# Altium schematic sheet construccionTransformador.SchDoc
size 145 x 103 mm
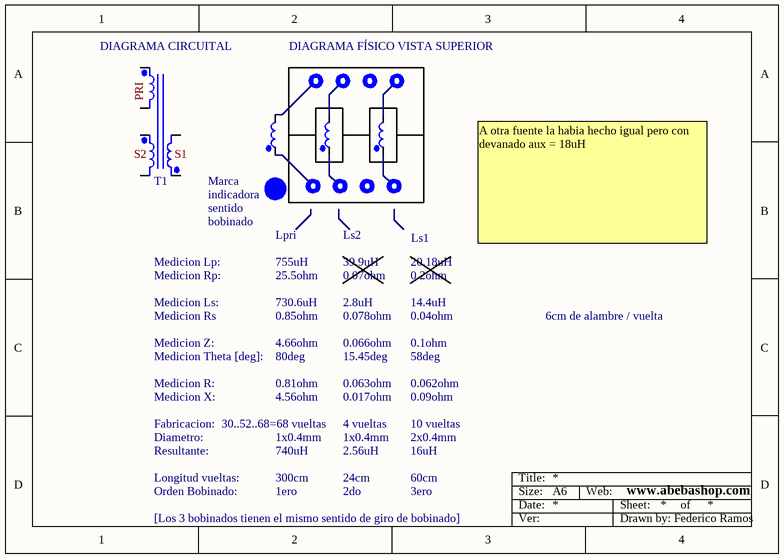
[diagram p0: construccionTransformador.SchDoc]

## Parts
Lpri  Inductor2  [TOROIDE TN14-9-5]  (value not drawn)
Ls1  Inductor2  [TOROIDE TN14-9-5]  (value not drawn)
Ls2  Inductor2  [TOROIDE TN14-9-5]  (value not drawn)
T1  Transformer 2  [COSMO - EE 2507]  (value not drawn)

## Blocks framed on the sheet
DIAGRAMA FÍSICO VISTA SUPERIOR: Ls1 Ls2

## Nets

Not connected (* = marked no-connect by the designer): Lpri 1 2; Ls1 1 2; Ls2 1 2; T1 1 2 3 4 5 6

## Notes on the sheet
- (near T1) DIAGRAMA CIRCUITAL
- Marca
- indicadora
- sentido
- bobinado
- A otra fuente la habia hecho igual pero con devanado aux = 18uH
- Medicion Lp:
- Medicion Rp:
- Medicion Ls:
- 755uH
- 25.5ohm
- 730.6uH
- 39.9uH
- 0.07ohm
- 2.8uH
- 20.18uH
- 0.2ohm
- 14.4uH
- Medicion Rs
- Medicion Z:
- Medicion Theta [deg]:
- 0.85ohm
- 4.66ohm
- 80deg
- 0.078ohm
- 0.066ohm
- 15.45deg
- 0.04ohm
- 0.1ohm
- 58deg
- 6cm de alambre / vuelta
- Fabricacion:
- Diametro:
- Medicion R:
- Medicion X:
- 30..52..68=68 vueltas
- 1x0.4mm
- 0.81ohm
- 4.56ohm
- 4 vueltas
- 0.063ohm
- 0.017ohm
- 10 vueltas
- 2x0.4mm
- 0.062ohm
- 0.09ohm
- Resultante:
- Longitud vueltas:
- Orden Bobinado:
- 740uH
- 300cm
- 1ero
- 2.56uH
- 24cm
- 2do
- 16uH
- 60cm
- 3ero
- [Los 3 bobinados tienen el mismo sentido de giro de bobinado]
- Labels drawn without touching a wire or pin: PRI, S1, S2
- Title:
- Size:
- Date:
- A6
- Web:
- Sheet:
- www.abebashop.com
- of
- Ver:
- Drawn by: Federico Ramos

## Library data of the parts
Lpri Ls1 Ls2 = Inductor2: Inductor; Value: 1mH; Revision: July-2002: Re-released for DXP Platform.
T1 = Transformer 2: Three-winding Transformer; Revision: July-2002: Re-released for DXP Platform.; Publisher: Altium Limited